# EAGLE schematic Desk Widget (EAGLE 9.3.0)
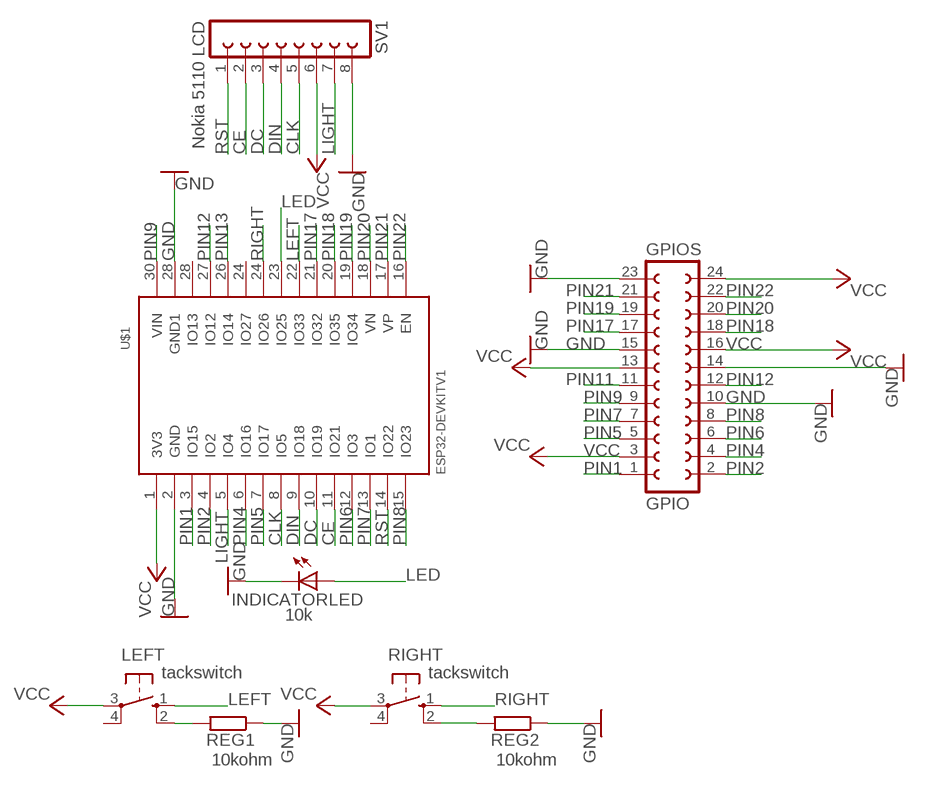
[diagram p0: schematic, sheet 1]

## Parts
GPIOS  GPIO  FE12-2W  [FE12-2W]
INDICATORLED  10k  LED3MM  [LED3MM]
LEFT  tackswitch  10-XX  [B3F-10XX]
REG1  10kohm  R-EU_0204/7  [0204/7]
REG2  10kohm  R-EU_0204/7  [0204/7]
RIGHT  tackswitch  10-XX  [B3F-10XX]
SV1  Nokia 5110 LCD  FE08-1  [FE08]
U$1  ESP32DEVKITV1  [ESP32-DEVKITV1]

## Nets
CE: SV1.2 U$1.11(IO21)
CLK: SV1.5 U$1.8(IO5)
DC: SV1.3 U$1.10(IO19)
DIN: SV1.4 U$1.9(IO18)
GND: GPIOS.10 GPIOS.14 GPIOS.15 GPIOS.23 INDICATORLED.K(C) REG1.1 REG2.1 SV1.8 U$1.2(GND) U$1.28(GND1)
LED: INDICATORLED.A U$1.23(IO25)
LEFT: LEFT.1(S) U$1.22(IO33)
LIGHT: SV1.7 U$1.5(IO4)
N$1: REG2.2 RIGHT.2(S1)
N$2: LEFT.2(S1) REG1.2
PIN1: GPIOS.1 U$1.3(IO15)
PIN2: GPIOS.2 U$1.4(IO2)
PIN4: GPIOS.4 U$1.6(IO16)
PIN5: GPIOS.5 U$1.7(IO17)
PIN6: GPIOS.6 U$1.12(IO3)
PIN7: GPIOS.7 U$1.13(IO1)
PIN8: GPIOS.8 U$1.15(IO23)
PIN9: GPIOS.9 U$1.30(VIN)
PIN11: GPIOS.11
PIN12: GPIOS.12 U$1.27(IO12)
PIN13: U$1.26(IO14)
PIN17: GPIOS.17 U$1.21(IO32)
PIN18: GPIOS.18 U$1.20(IO35)
PIN19: GPIOS.19 U$1.19(IO34)
PIN20: GPIOS.20 U$1.18(VN)
PIN21: GPIOS.21 U$1.17(VP)
PIN22: GPIOS.22 U$1.16(EN)
RIGHT: RIGHT.1(S) U$1.24(IO26)
RST: SV1.1 U$1.14(IO22)
VCC: GPIOS.3 GPIOS.13 GPIOS.16 GPIOS.24 LEFT.3(P) RIGHT.3(P) SV1.6 U$1.1(3V3)
Unconnected: LEFT.4(P1) RIGHT.4(P1) U$1.24(IO27) U$1.28(IO13)

## Library data of the parts
GPIOS = con-lsta:FE12-2W: FEMALE HEADER; OC_FARNELL: unknown; OC_NEWARK: unknown
INDICATORLED = led:LED: LED OSRAM: - CHIPLED LG R971, LG N971, LY N971, LG Q971, LY Q971, LO R971, LY R971 LH N974, LH R974 LS Q976, LO Q976, LY Q976 LO Q996 - Hyper CHIPLED LW Q18S LB Q993, LB Q99A, LB R99A - SideLED LS A670, LO A670, LY A670, LG A670, LP A670 LB A673, LV A673, LT A673, LW A673 LH A674 LY A675 LS A676, LA A676, LO A676, LY A676, LW A676 LS A679, LY A679, LG A679 - Hyper Micro SIDELED® LS Y876, LA Y876, LO Y876, LY Y876 LT Y87S - SmartLED LW L88C, LW L88S LB L89C, LB L89S, LG L890 LS L89K, LO L89K, LY L89K LS L896, LA L896, LO L896, LY L896 - TOPLED LS T670, LO T670, LY T670, LG T670, LP T670 LSG T670, LSP T670, LSY T670, LOP T670, LYG T670 LG T671, LOG T671, LSG T671 LB T673, LV T673, LT T673, LW T673 LH T674 LS T676, LA T676, LO T676, LY T676, LB T676, LH T676, LSB T676, LW T676 LB T67C, LV T67C, LT T67C, LS T67K, LO T67K, LY T67K, LW E67C LS E67B, LA E67B, LO E67B, LY E67B, LB E67C, LV E67C, LT E67C LW T67C LS T679, LY T679, LG T679 LS T770, LO T770, LY T770, LG T770, LP T770 LB T773, LV T773, LT T773, LW T773 LH T774 LS E675, LA E675, LY E675, LS T675 LS T776, LA T776, LO T776, LY T776, LB T776 LHGB T686 LT T68C, LB T68C - Hyper Mini TOPLED® LB M676 - Mini TOPLED Santana® LG M470 LS M47K, LO M47K, LY M47K Source: http://www.osram.convergy.de LUXEON: - LUMILED® LXK2-PW12-R00, LXK2-PW12-S00, LXK2-PW14-U00, LXK2-PW14-V00 LXK2-PM12-R00, LXK2-PM12-S00, LXK2-PM14-U00 LXK2-PE12-Q00, LXK2-PE12-R00, LXK2-PE12-S00, LXK2-PE14-T00, LXK2-PE14-U00 LXK2-PB12-K00, LXK2-PB12-L00, LXK2-PB12-M00, LXK2-PB14-N00, LXK2-PB14-P00, LXK2-PB14-Q00 LXK2-PR12-L00, LXK2-PR12-M00, LXK2-PR14-Q00, LXK2-PR14-R00 LXK2-PD12-Q00, LXK2-PD12-R00, LXK2-PD12-S00 LXK2-PH12-R00, LXK2-PH12-S00 LXK2-PL12-P00, LXK2-PL12-Q00, LXK2-PL12-R00 Source: www.luxeon.com KINGBRIGHT: KA-3528ASYC Source: www.kingbright.com
LEFT RIGHT = buttons:10-XX: OMRON SWITCH
REG1 REG2 = resistor:R-EU_: RESISTOR, European symbol
SV1 = con-lsta:FE08-1: FEMALE HEADER; OC_FARNELL: unknown; OC_NEWARK: unknown
U$1 = ESP32-DEVKITV1:ESP32DEVKITV1